# EasyEDA schematic SCH_FZ-1-OLED_2025-06-02.json
TITLE: OLED display for Casio FZ-1; REV: A; Sheet: 1/1; Drawn By: dmitrins
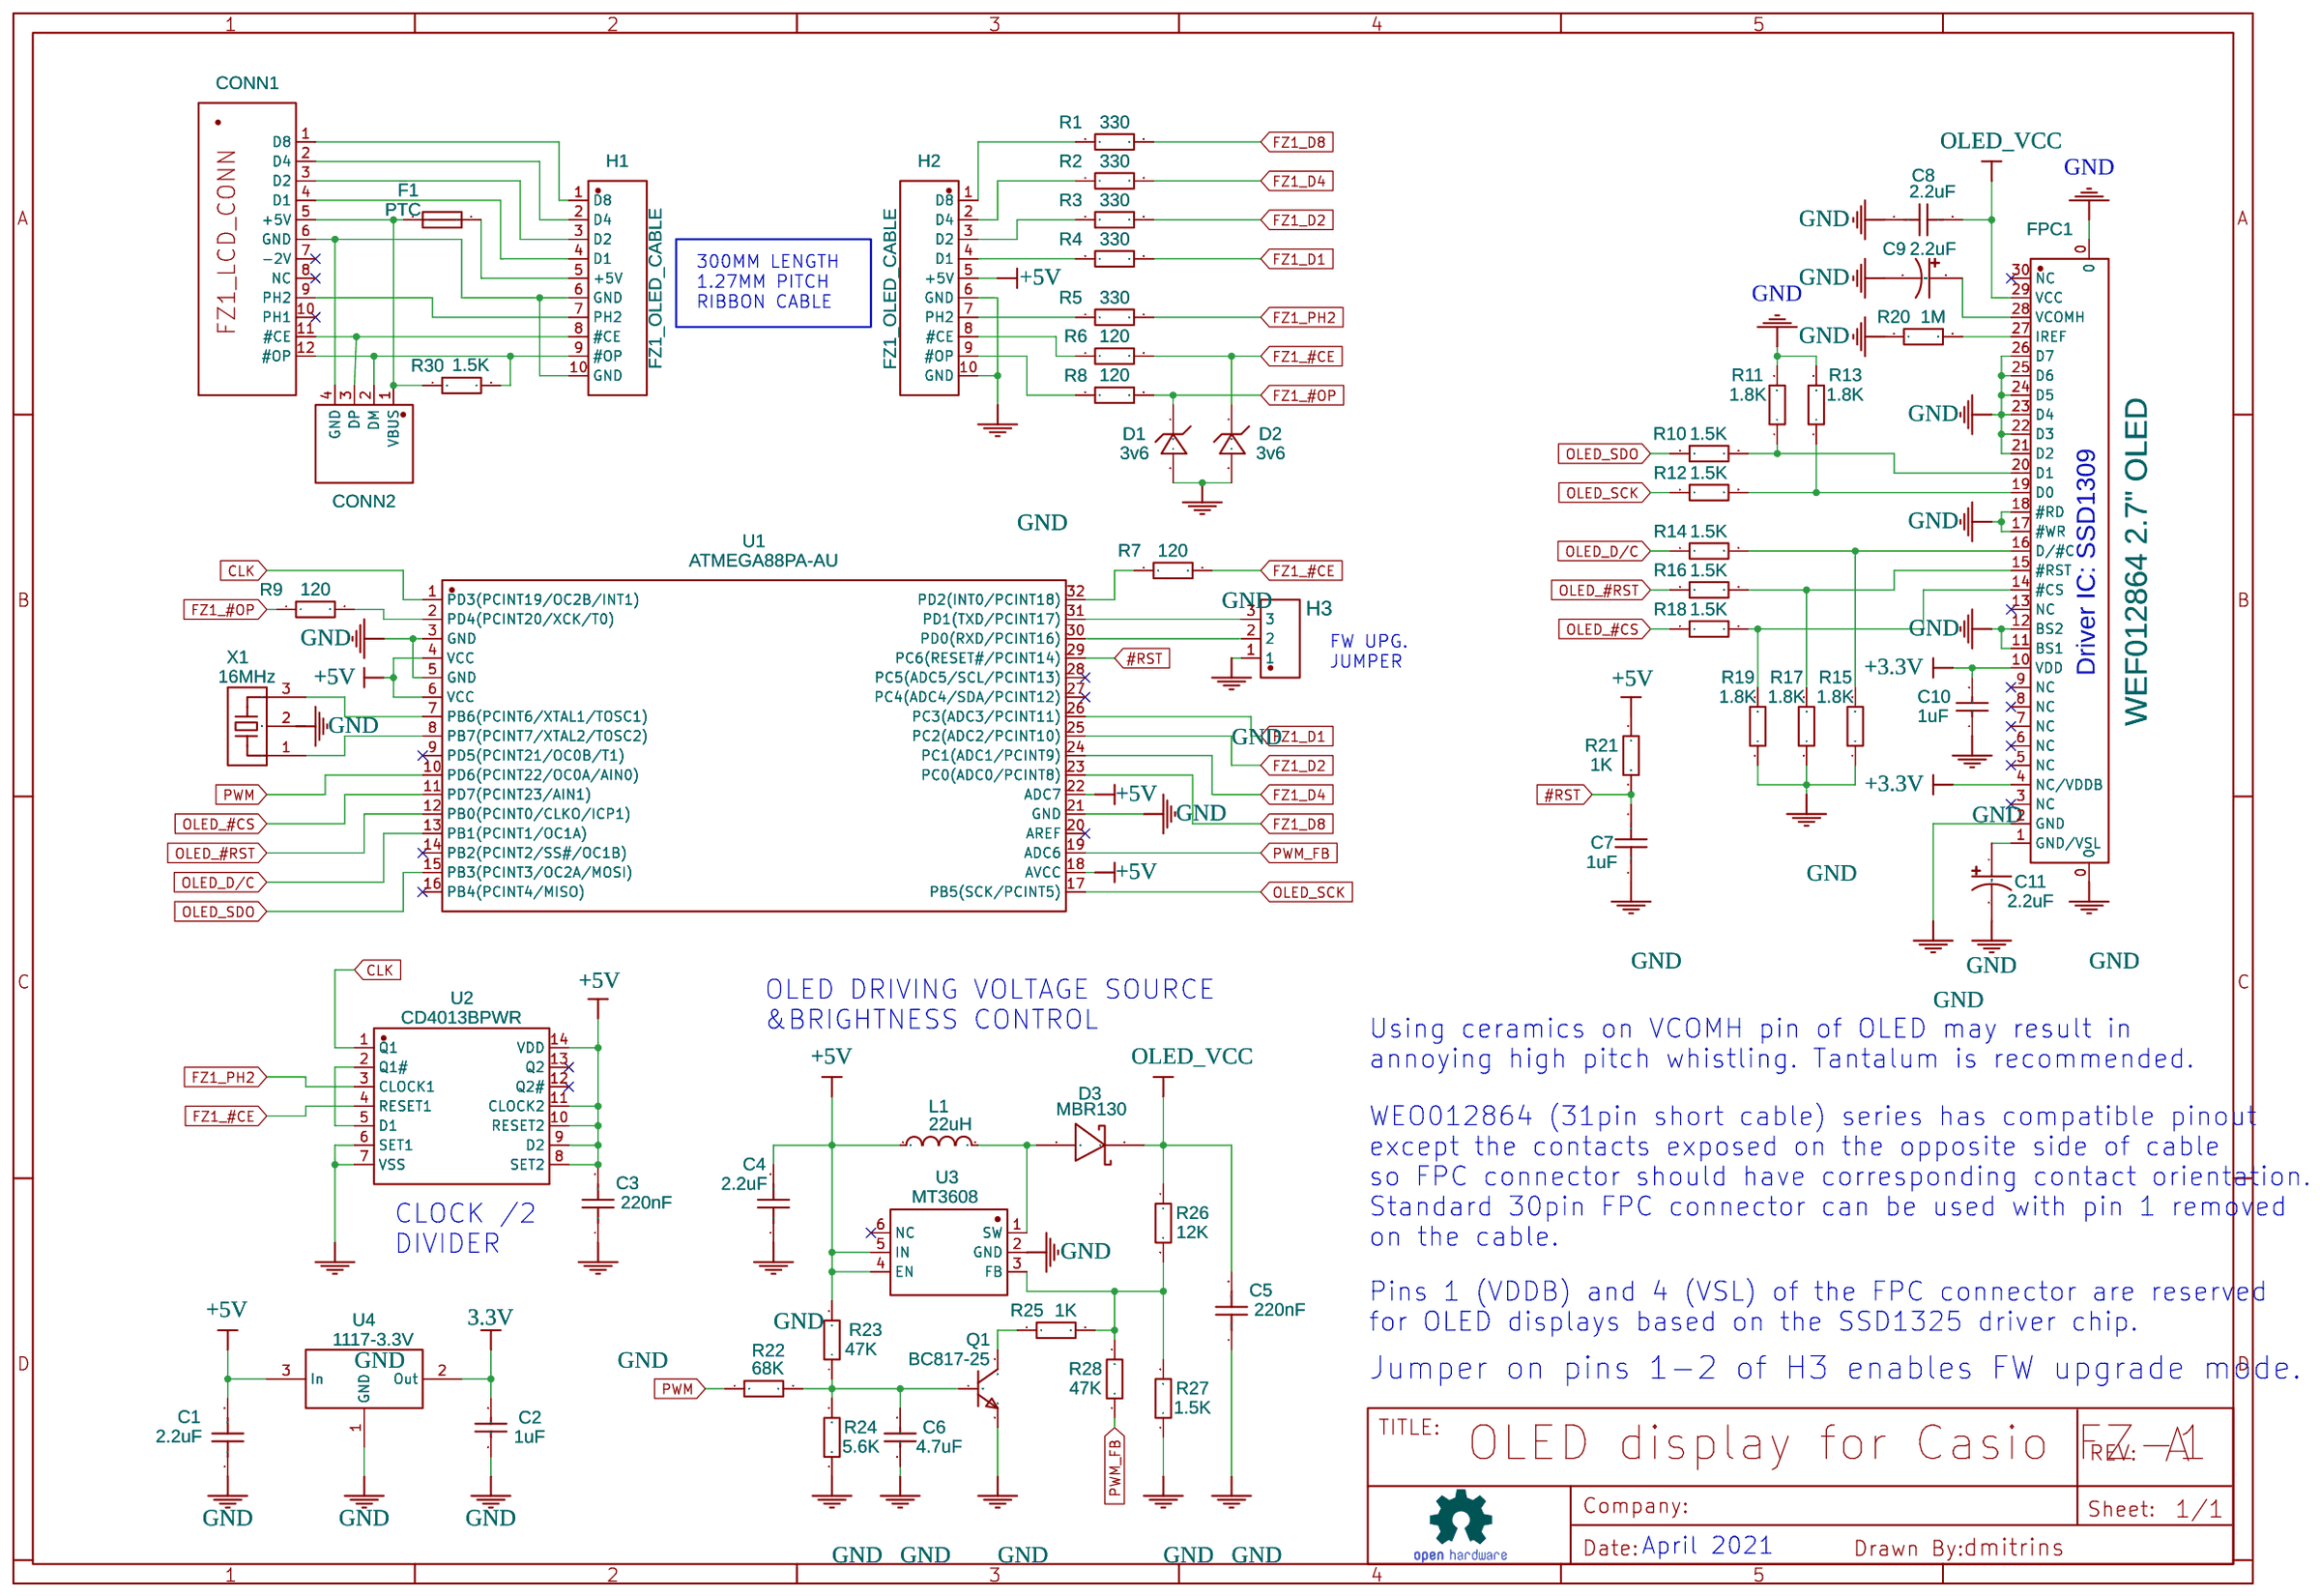
[diagram p0: schematic sheet]

## Parts
C1  2.2uF  [C0805]
C2  1uF  [C0805]
C3  220nF  [C0603]
C4  2.2uF  [C0805]
C5  220nF  [C0603]
C6  4.7uF  [C0805]
C7  1uF  [C0603]
C8  2.2uF  [C0805]
C9  2.2uF  [CAP-SMD_L3.5-W2.8]
C10  1uF  [C0805]
C11  2.2uF  [CAP-SMD_L3.5-W2.8]
CONN1  FZ1_LCD_CONN  [FZ1_LCD_CONN]
CONN2  FZ1_USB_CONN  [USB_PCB]
D1  3v6  [SOD-123_L2.7-W1.6-LS3.7-RD]
D2  3v6  [SOD-123_L2.7-W1.6-LS3.7-RD]
D3  MBR130  [SOD-123F_L2.8-W1.8-LS3.7-RD]
F1  PTC  [F1206]
FPC1  WEF012864 2.7" OLED  [FPC-SMD_P0.50-30P_XJ-CLS]
H1  FZ1_OLED_CABLE  [HDR-TH_10P-P1.27-V]
H2  FZ1_OLED_CABLE  [HDR-TH_10P-P1.27-V]
H3  GP26-2520WV-3P  [HDR-TH_3P-P2.54-V-M]
L1  22uH  [IND-SMD_L3.0-W3.0_LQH3NPN]
Q1  BC817-25  [SOT-23-3_L2.9-W1.3-P1.90-LS2.4-BR]
R1  330  [R0603]
R2  330  [R0603]
R3  330  [R0603]
R4  330  [R0603]
R5  330  [R0603]
R6  120  [R0603]
R7  120  [R0603]
R8  120  [R0603]
R9  120  [R0603]
R10  1.5K  [R0603]
R11  1.8K  [R0603]
R12  1.5K  [R0603]
R13  1.8K  [R0603]
R14  1.5K  [R0603]
R15  1.8K  [R0603]
R16  1.5K  [R0603]
R17  1.8K  [R0603]
R18  1.5K  [R0603]
R19  1.8K  [R0603]
R20  1M  [R0603]
R21  1K  [R0603]
R22  68K  [R0603]
R23  47K  [R0603]
R24  5.6K  [R0603]
R25  1K  [R0603]
R26  12K  [R0603]
R27  1.5K  [R0603]
R28  47K  [R0603]
R30  1.5K  [R0603]
U1  ATMEGA88PA-AU  [TQFP-32_L7.0-W7.0-P0.80-LS9.0-BL]
U2  CD4013BPWR  [TSSOP-14_L5.0-W4.4-P0.65-LS6.4-BL]
U3  MT3608  [SOT-23-6_L2.9-W1.6-P0.95-LS2.8-BR]
U4  1117-3.3V  [AMS_1117]
X1  16MHz  [OSC-SMD_3P-L3.2-W1.3-P0.95-L]

## Library data of the parts
C1 C4 C8 = GRM219R61H225KE15D: Supplier: LCSC; Supplier Part: C162299; Manufacturer: Murata Electronics; Contributor: LCSC
C2 C10 = GCM21BR71H105KA03L: Supplier: LCSC; Manufacturer: MuRata; Supplier Part: C126592
C3 C5 = GCJ188R71H224KA01D: Supplier: LCSC; Supplier Part: C354388; Manufacturer: Murata Electronics; Contributor: LCSC
C6 = GRM21BR61C475KA88L: Supplier: LCSC; Manufacturer: MuRata; Contributor: LCSC; Supplier Part: C97915
C7 = GRM188R71C105KE15D: Supplier: LCSC; Manufacturer: MuRata; Supplier Part: C77049
C9 C11 = 293D225X9025B2TE3: Supplier: LCSC; Supplier Part: C215887; Manufacturer: Vishay Intertech; Contributor: LCSC
CONN1 = FZ1_LCD_CONN: Contributor: Dmitri N
CONN2 = FZ1_USB_CONN: Contributor: Dmitri N
D1 D2 = MMSZ5227BT1G: Supplier Part: C154803; Supplier: LCSC; Manufacturer: ON; Contributor: LCSC; SMT Type: Extend; JLCPCB SMD: Yes; LCSC Assembly: Yes; Paste Type: expand
D3 = shottky: Supplier: LCSC; Supplier Part: C235756; Manufacturer: ON Semicon; Manufacturer Part: MBR130LSFT1G; Contributor: LCEDA_Lib
F1 = MF-NSMF035-2: Supplier: LCSC; Manufacturer: BOURNS; Supplier Part: C89652
FPC1 = FPC0.5-30P_C132512: Supplier: LCSC; Supplier Part: C132512; Manufacturer: Shenzhen Cankemeng; Contributor: 立创EDA官方封装库
H1 H2 = FZ1_OLED_CABLE: Contributor: Dmitri N
H3 = GP26-2520WV-3P: Supplier: LCSC; Supplier Part: C2681738; Manufacturer: GEPU(歌普); Paste Type: expand; Contributor: LCSC
L1 = LQH3NPN220MGRL: Supplier: LCSC; Supplier Part: C237408; Manufacturer: Murata Electronics; Contributor: LCSC
Q1 = BC817-25LT3G: Supplier: LCSC; Supplier Part: C191221; Manufacturer: ON Semicon; Contributor: LCSC; SMT Type: Extend; JLCPCB SMD: Yes; LCSC Assembly: Yes; Paste Type: expand
R1-R5 = 0603WAF3300T5E: Supplier: LCSC; Manufacturer: UniOhm; Supplier Part: C23138; SMT Type: Basic; JLCPCB SMD: Yes; LCSC Assembly: Yes; Paste Type: base
R6-R9 = 0603WAF1200T5E: Supplier: LCSC; Manufacturer: UniOhm; Supplier Part: C22787; SMT Type: Basic; JLCPCB SMD: Yes; LCSC Assembly: Yes; Paste Type: base
R10 R12 R14 R16 R18 R27 R30 = 0603WAF1501T5E: Supplier: LCSC; Manufacturer: UniOhm; Supplier Part: C22843; SMT Type: Basic; JLCPCB SMD: Yes; LCSC Assembly: Yes; Paste Type: base
R11 R13 R15 R17 R19 = 0603WAF1801T5E: Supplier: LCSC; Manufacturer: UniOhm; Supplier Part: C4177; SMT Type: Basic; JLCPCB SMD: Yes; LCSC Assembly: Yes; Paste Type: base
R20 = 0603WAF1004T5E: Supplier: LCSC; Manufacturer: UniOhm; Supplier Part: C22935; SMT Type: Basic; JLCPCB SMD: Yes; LCSC Assembly: Yes; Paste Type: base
R21 R25 = 0603WAF1001T5E: Supplier: LCSC; Manufacturer: UniOhm; Supplier Part: C21190; SMT Type: Basic; JLCPCB SMD: Yes; LCSC Assembly: Yes; Paste Type: base
R22 = 0603WAJ0683T5E: Supplier: LCSC; Manufacturer: UniOhm; Supplier Part: C25607; Paste Type: expand
R23 R28 = 0603WAF4702T5E: Supplier: LCSC; Manufacturer: UniOhm; Supplier Part: C25819; SMT Type: Basic; JLCPCB SMD: Yes; LCSC Assembly: Yes; Paste Type: base
R24 = 0603WAF5601T5E: Supplier: LCSC; Manufacturer: UniOhm; Supplier Part: C23189; SMT Type: Basic; JLCPCB SMD: Yes; LCSC Assembly: Yes; Paste Type: base
R26 = 0603WAF1202T5E: Supplier: LCSC; Manufacturer: UniOhm; Supplier Part: C22790; SMT Type: Basic; JLCPCB SMD: Yes; LCSC Assembly: Yes; Paste Type: base
U1 = ATMEGA88PA-AU: Supplier: LCSC; Manufacturer: MICROCHIP; image: //image.lceda.cn/szlcsc/C8727.jpg; Supplier Part: C8727; SMT Type: Extend; JLCPCB SMD: Yes; Paste Type: recommend
U2 = CD4013BPWR: Supplier: LCSC; Supplier Part: C406860; Manufacturer: Texas Instruments; Contributor: LCSC; SMT Type: Extend; JLCPCB SMD: Yes; LCSC Assembly: Yes; Paste Type: expand
U3 = MT3608: Supplier: LCSC; Manufacturer: AEROSEMI; Supplier Part: C84817; SMT Type: Extend; JLCPCB SMD: Yes; Paste Type: recommend
U4 = 1117-3.3V: sourceId: dwIGgezVh; Supplier Part: C6186; Supplier: LCSC; Manufacturer: AMS; Manufacturer Part: AMS1117-3.3; Contributor: Ricardo Sinkha
X1 = CSTCE16M0V53-R0: Supplier: LCSC; Manufacturer: MuRata; Supplier Part: C32180; LCSC Assembly: Yes; SMT Type: Extend; Paste Type: expand

## Nets
3.3V: C2.2 U4.2(Out)
+3.3V: C10.2 FPC1.4(NC/VDDB) FPC1.10(VDD)
+5V: C1.2 C3.2 C4.2 H2.5(+5V) L1.1 R21.2 R23.2 U1.4(VCC) U1.6(VCC) U1.18(AVCC) U1.22(ADC7) U2.8(SET2) U2.9(D2) U2.10(RESET2) U2.11(CLOCK2) U2.14(VDD) U3.4(EN) U3.5(IN) U4.3(In)
GND: C1.1 C2.1 C3.1 C4.1 C5.1 C6.1 C7.2 C8.1 C9.2 C10.1 C11.2 D1.2(A) D2.2(A) FPC1.0 FPC1.2(GND) FPC1.11(BS1) FPC1.12(BS2) FPC1.17(#WR) FPC1.18(#RD) FPC1.21(D2) FPC1.22(D3) FPC1.23(D4) FPC1.24(D5) FPC1.25(D6) FPC1.26(D7) H2.6(GND) H2.10(GND) H3.1 Q1.2(E) R11.2 R13.2 R15.1 R17.1 R19.1 R20.1 R24.1 R27.1 U1.3(GND) U1.5(GND) U1.21(GND) U2.6(SET1) U2.7(VSS) U3.2(GND) U4.1(GND) X1.2
#RST: C7.1 R21.1 U1.29(PC6(RESET#/PCINT14))
CLK: U1.1(PD3(PCINT19/OC2B/INT1)) U2.1(Q1)
FZ1_#CE: D2.1(C) R6.2 R7.2 U2.4(RESET1)
FZ1_#OP: D1.1(C) R8.2 R9.1
FZ1_D1: R4.2 U1.26(PC3(ADC3/PCINT11))
FZ1_D2: R3.2 U1.25(PC2(ADC2/PCINT10))
FZ1_D4: R2.2 U1.24(PC1(ADC1/PCINT9))
FZ1_D8: R1.2 U1.23(PC0(ADC0/PCINT8))
FZ1_PH2: R5.2 U2.3(CLOCK1)
OLED_#CS: R18.1 U1.11(PD7(PCINT23/AIN1))
OLED_#RST: R16.1 U1.12(PB0(PCINT0/CLKO/ICP1))
OLED_D/C: R14.1 U1.13(PB1(PCINT1/OC1A))
OLED_SCK: R12.1 U1.17(PB5(SCK/PCINT5))
OLED_SDO: R10.1 U1.15(PB3(PCINT3/OC2A/MOSI))
OLED_VCC: C5.2 C8.2 D3.1 FPC1.29(VCC) R26.1
PWM: R22.1 U1.10(PD6(PCINT22/OC0A/AIN0))
PWM_FB: R28.1 U1.19(ADC6)
Net-(C6-2): C6.2 Q1.1(B) R22.2 R23.1 R24.2
Net-(C9-1): C9.1 FPC1.28(VCOMH)
Net-(C11-1): C11.1 FPC1.1(GND/VSL)
Net-(CONN1-1): CONN1.1(D8) H1.1(D8)
Net-(CONN1-2): CONN1.2(D4) H1.2(D4)
Net-(CONN1-3): CONN1.3(D2) H1.3(D2)
Net-(CONN1-4): CONN1.4(D1) H1.4(D1)
Net-(CONN1-5): CONN1.5(+5V) CONN2.1(VBUS) F1.1 R30.1
Net-(CONN1-6): CONN1.6(GND) CONN2.4(GND) H1.6(GND) H1.10(GND)
Net-(CONN1-9): CONN1.9(PH2) H1.7(PH2)
Net-(CONN1-11): CONN1.11(#CE) CONN2.3(DP) H1.8(#CE)
Net-(CONN1-12): CONN1.12(#OP) CONN2.2(DM) H1.9(#OP) R30.2
Net-(D3-2): D3.2 L1.2 U3.1(SW)
Net-(F1-2): F1.2 H1.5(+5V)
Net-(FPC1-14): FPC1.14(#CS) R18.2 R19.2
Net-(FPC1-15): FPC1.15(#RST) R16.2 R17.2
Net-(FPC1-16): FPC1.16(D/#C) R14.2 R15.2
Net-(FPC1-19): FPC1.19(D0) R12.2 R13.1
Net-(FPC1-20): FPC1.20(D1) R10.2 R11.1
Net-(FPC1-27): FPC1.27(IREF) R20.2
Net-(H2-1): H2.1(D8) R1.1
Net-(H2-2): H2.2(D4) R2.1
Net-(H2-3): H2.3(D2) R3.1
Net-(H2-4): H2.4(D1) R4.1
Net-(H2-7): H2.7(PH2) R5.1
Net-(H2-8): H2.8(#CE) R6.1
Net-(H2-9): H2.9(#OP) R8.1
Net-(H3-2): H3.2 U1.30(PD0(RXD/PCINT16))
Net-(H3-3): H3.3 U1.31(PD1(TXD/PCINT17))
Net-(Q1-3): Q1.3(C) R25.1
Net-(R7-1): R7.1 U1.32(PD2(INT0/PCINT18))
Net-(R9-2): R9.2 U1.2(PD4(PCINT20/XCK/T0))
Net-(R25-2): R25.2 R26.2 R27.2 R28.2 U3.3(FB)
Net-(U1-7): U1.7(PB6(PCINT6/XTAL1/TOSC1)) X1.3
Net-(U1-8): U1.8(PB7(PCINT7/XTAL2/TOSC2)) X1.1
Net-(U2-2): U2.2(Q1#) U2.5(D1)

Not connected (* = marked no-connect by the designer): CONN1 7(-2V)* 8(NC)* 10(PH1)*; FPC1 3(NC)* 5(NC)* 6(NC)* 7(NC)* 8(NC)* 9(NC)* 13(NC)* 30(NC)*; U1 9(PD5(PCINT21/OC0B/T1))* 14(PB2(PCINT2/SS#/OC1B))* 16(PB4(PCINT4/MISO))* 20(AREF)* 27(PC4(ADC4/SDA/PCINT12))* 28(PC5(ADC5/SCL/PCINT13))*; U2 12(Q2#)* 13(Q2)*; U3 6(NC)*

## Notes on the sheet
- 300MM LENGTH
  1.27MM PITCH
  RIBBON CABLE
- FW UPG.
  JUMPER
- Driver IC: SSD1309
- OLED DRIVING VOLTAGE SOURCE
  &BRIGHTNESS CONTROL
- Using ceramics on VCOMH pin of OLED may result in
  annoying high pitch whistling. Tantalum is recommended.
- WEO012864 (31pin short cable) series has compatible pinout
  except the contacts exposed on the opposite side of cable
  so FPC connector should have corresponding contact orientation.
  Standard 30pin FPC connector can be used with pin 1 removed
  on the cable.
- CLOCK /2
  DIVIDER
- Pins 1 (VDDB) and 4 (VSL) of the FPC connector are reserved
  for OLED displays based on the SSD1325 driver chip.
- Jumper on pins 1-2 of H3 enables FW upgrade mode.
- April 2021
